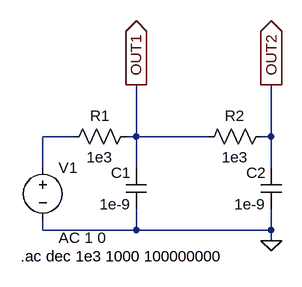
[diagram p0: schematic RC_filter.asc]
RC_filter.asc, the LTspice schematic file:
Version 4
SHEET 1 880 680
WIRE 16 80 -32 80
WIRE 112 80 112 0
WIRE 112 80 96 80
WIRE 224 80 112 80
WIRE 320 80 320 0
WIRE 320 80 304 80
WIRE -32 128 -32 80
WIRE 112 128 112 80
WIRE 320 128 320 80
WIRE -32 224 -32 208
WIRE 112 224 112 192
WIRE 112 224 -32 224
WIRE 320 224 320 192
WIRE 320 224 112 224
WIRE 320 240 320 224
FLAG 320 240 0
FLAG 112 0 OUT1
IOPIN 112 0 Out
FLAG 320 0 OUT2
IOPIN 320 0 Out
SYMBOL res 0 96 R270
WINDOW 0 32 56 VTop 2
WINDOW 3 0 56 VBottom 2
SYMATTR InstName R1
SYMATTR Value 1e3
SYMBOL res 320 64 R90
WINDOW 0 0 56 VBottom 2
WINDOW 3 32 56 VTop 2
SYMATTR InstName R2
SYMATTR Value 1e3
SYMBOL cap 128 192 R180
WINDOW 0 24 56 Left 2
WINDOW 3 24 8 Left 2
SYMATTR InstName C1
SYMATTR Value 1e-9
SYMBOL cap 336 192 R180
WINDOW 0 24 56 Left 2
WINDOW 3 24 8 Left 2
SYMATTR InstName C2
SYMATTR Value 1e-9
SYMBOL voltage -32 112 R0
WINDOW 123 24 124 Left 2
WINDOW 39 0 0 Left 0
SYMATTR InstName V1
SYMATTR Value ""
SYMATTR Value2 AC 1 0
TEXT -66 264 Left 2 !.ac dec 1e3 1000 100000000

The netlist it stands for:
* RC_filter.asc
R1 N001 OUT1 1e3
R2 OUT2 OUT1 1e3
C1 0 OUT1 1e-9
C2 0 OUT2 1e-9
V1 N001 0 AC 1 0
.ac dec 1e3 1000 100000000
.backanno
.end